# EasyEDA Pro project 分电板.eprj

# Schematic Schematic1
Board Name: Board1; Create Date: 2024-11-13; Page Name: P1; Project Name: 分电板; Schematic Name: Schematic1; Update Date: 2024-11-14; Company: 嘉立创EDA; Page Size: A4; Version: V1.0
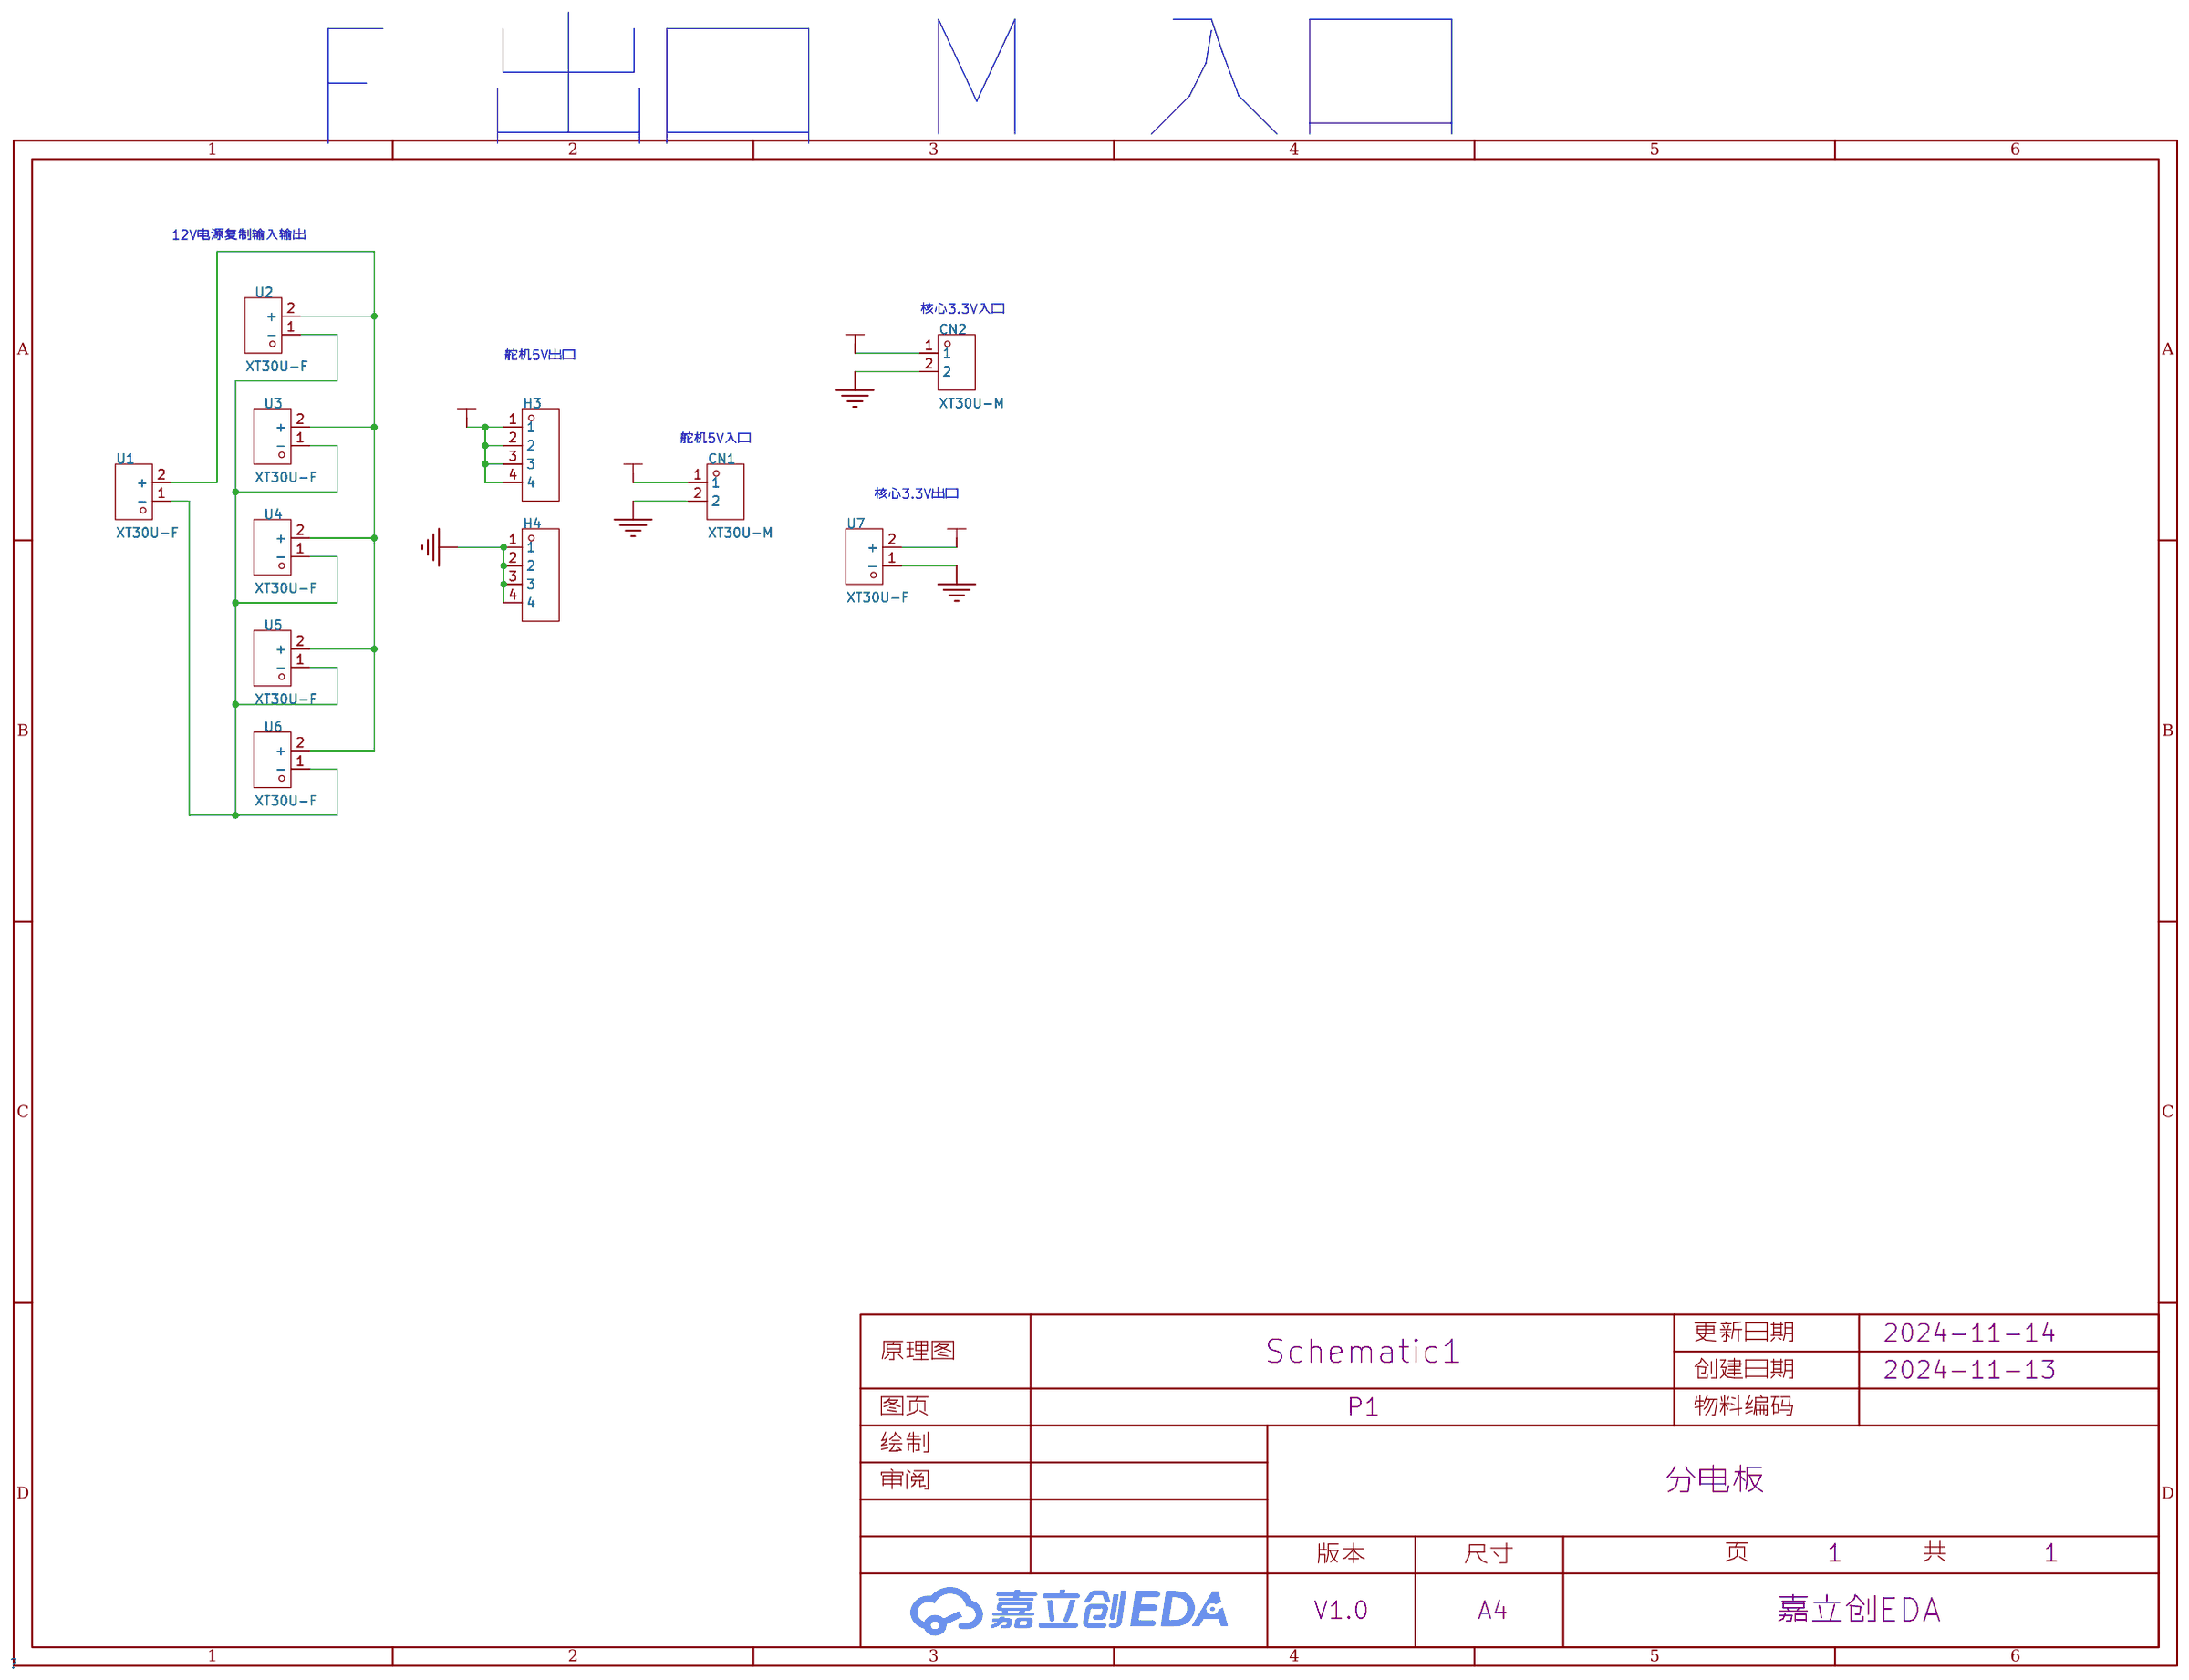
[diagram p0: schematic sheet]

## Parts
CN1  XT30U-M  [CONN-TH_XT30U-M]
CN2  XT30U-M  [CONN-TH_XT30U-M]
H3  -  [HDR-TH_4P-P2.54-V-M]
H4  -  [HDR-TH_4P-P2.54-V-M]
U1  XT30U-F  [CONN-TH_XT30U-F]
U2  XT30U-F  [CONN-TH_XT30U-F]
U3  XT30U-F  [CONN-TH_XT30U-F]
U4  XT30U-F  [CONN-TH_XT30U-F]
U5  XT30U-F  [CONN-TH_XT30U-F]
U6  XT30U-F  [CONN-TH_XT30U-F]
U7  XT30U-F  [CONN-TH_XT30U-F]

## Library data of the parts
CN1 CN2 = XT30U-M: LCSC Part Name: AMASS(艾迈斯)轻量版锂电池插头公头 XT30U-M; Supplier Part: C99101; Manufacturer: AMASS(艾迈斯); JLCPCB Part Class: Extended Part; Datasheet: https://atta.szlcsc.com/upload/public/pdf/source/20170606/1496716542582.pdf; Supplier: LCSC; Brand: 艾迈斯; Type: 插头; Colour: 黄色; InterfaceType: 公头
H3 H4 = HDR-M_2.54_1x4P: Supplier Part: C492403; Supplier Footprint: 插件
U1-U7 = XT30U-F: LCSC Part Name: AMASS(艾迈斯)轻量版锂电池插头母头 XT30U-F; Supplier Part: C99102; Manufacturer: AMASS(艾迈斯); JLCPCB Part Class: Extended Part; Datasheet: https://atta.szlcsc.com/upload/public/pdf/source/20190916/C428721_B0ECB8C5937139CEFE8736D2D3175B0E.pdf; Supplier: LCSC; Brand: 艾迈斯; Type: 插头; Colour: 黄色; InterfaceType: 母头

## Nets
3.3V: CN2.1 U7.2(+)
5V: CN1.1 H3.1 H3.2 H3.3 H3.4
GND: CN1.2 CN2.2 H4.1 H4.2 H4.3 H4.4 U7.1(-)
$1N694: U1.2(+) U2.2(+) U3.2(+) U4.2(+) U5.2(+) U6.2(+)
$1N789: U1.1(-) U2.1(-) U3.1(-) U4.1(-) U5.1(-) U6.1(-)

## Notes on the sheet
- M 入口
- F 出口
- 12V电源复制输入输出
- 核心3.3V入口
- 舵机5V出口
- 舵机5V入口
- 核心3.3V出口

# Board PCB1
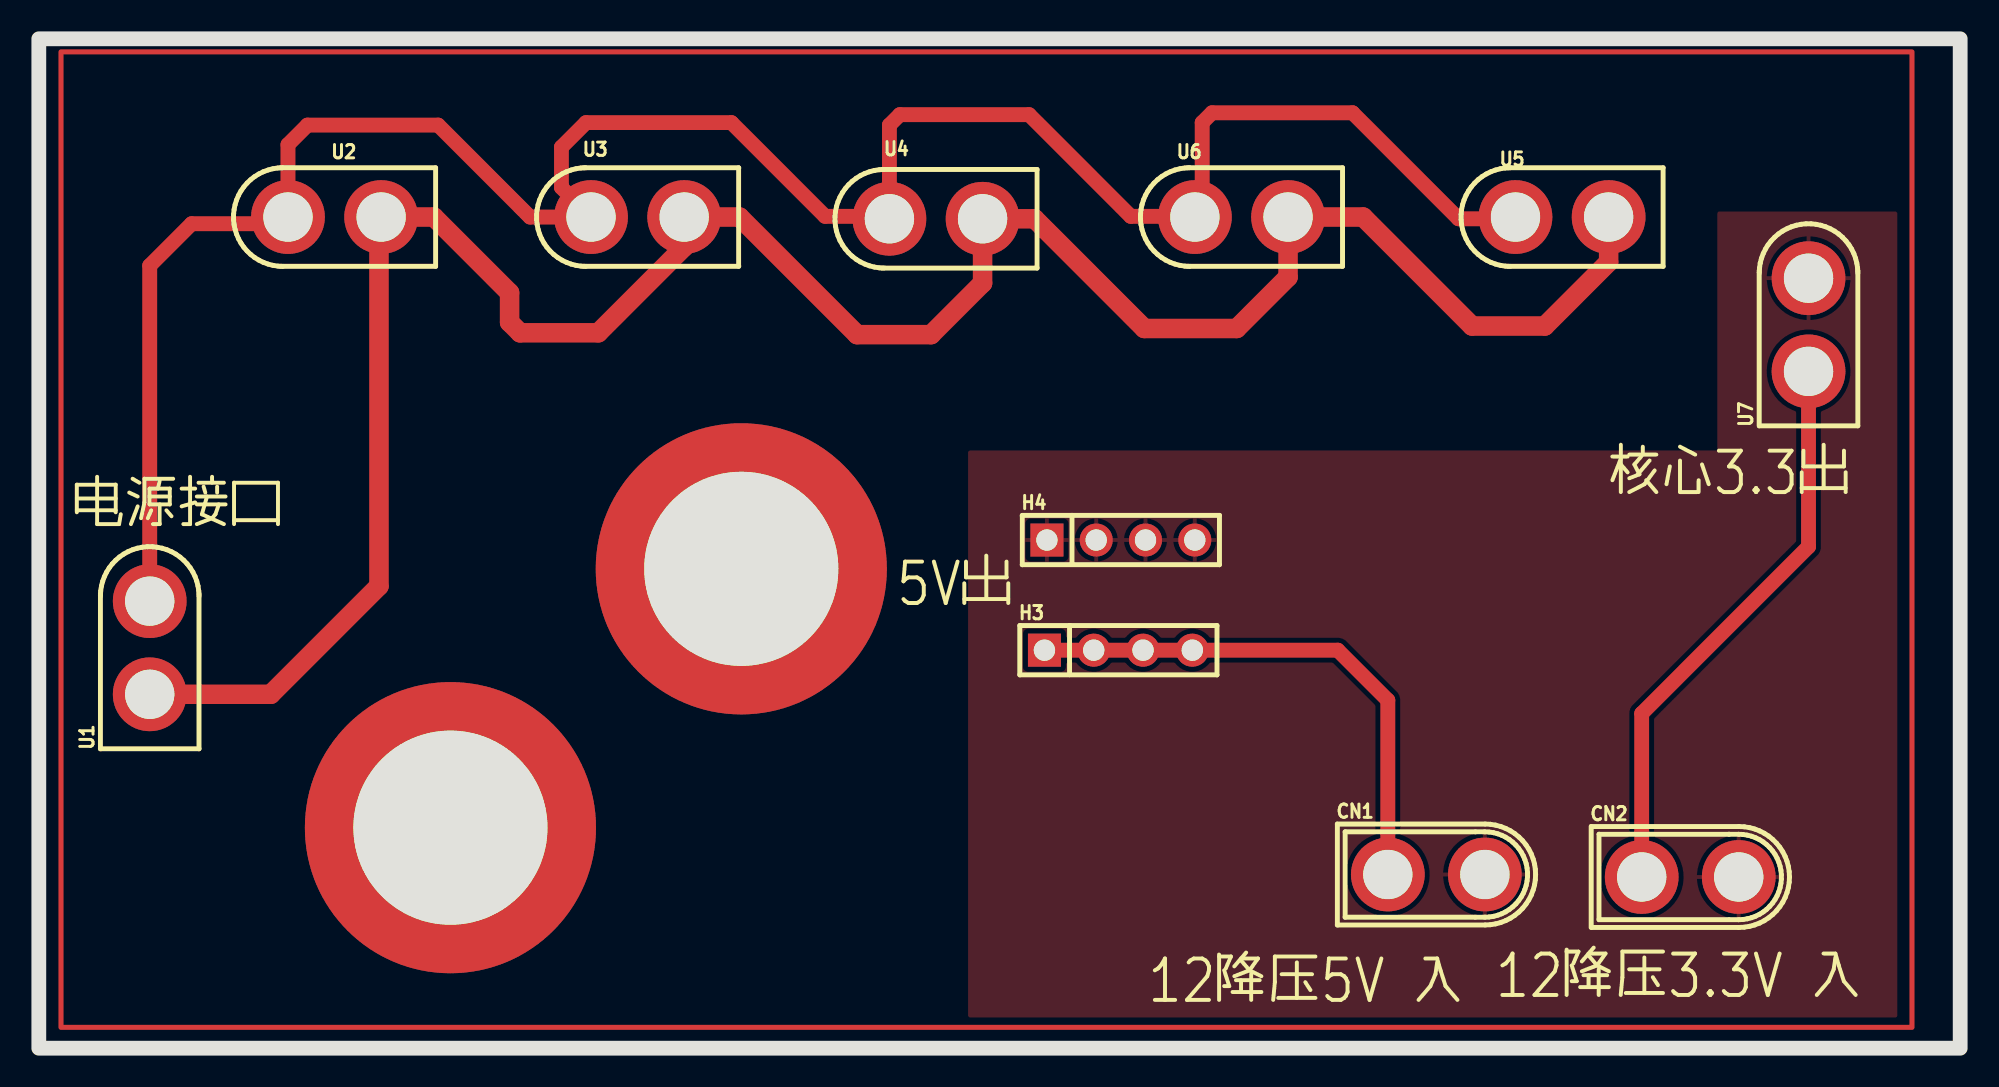
[diagram p1: board, top side]
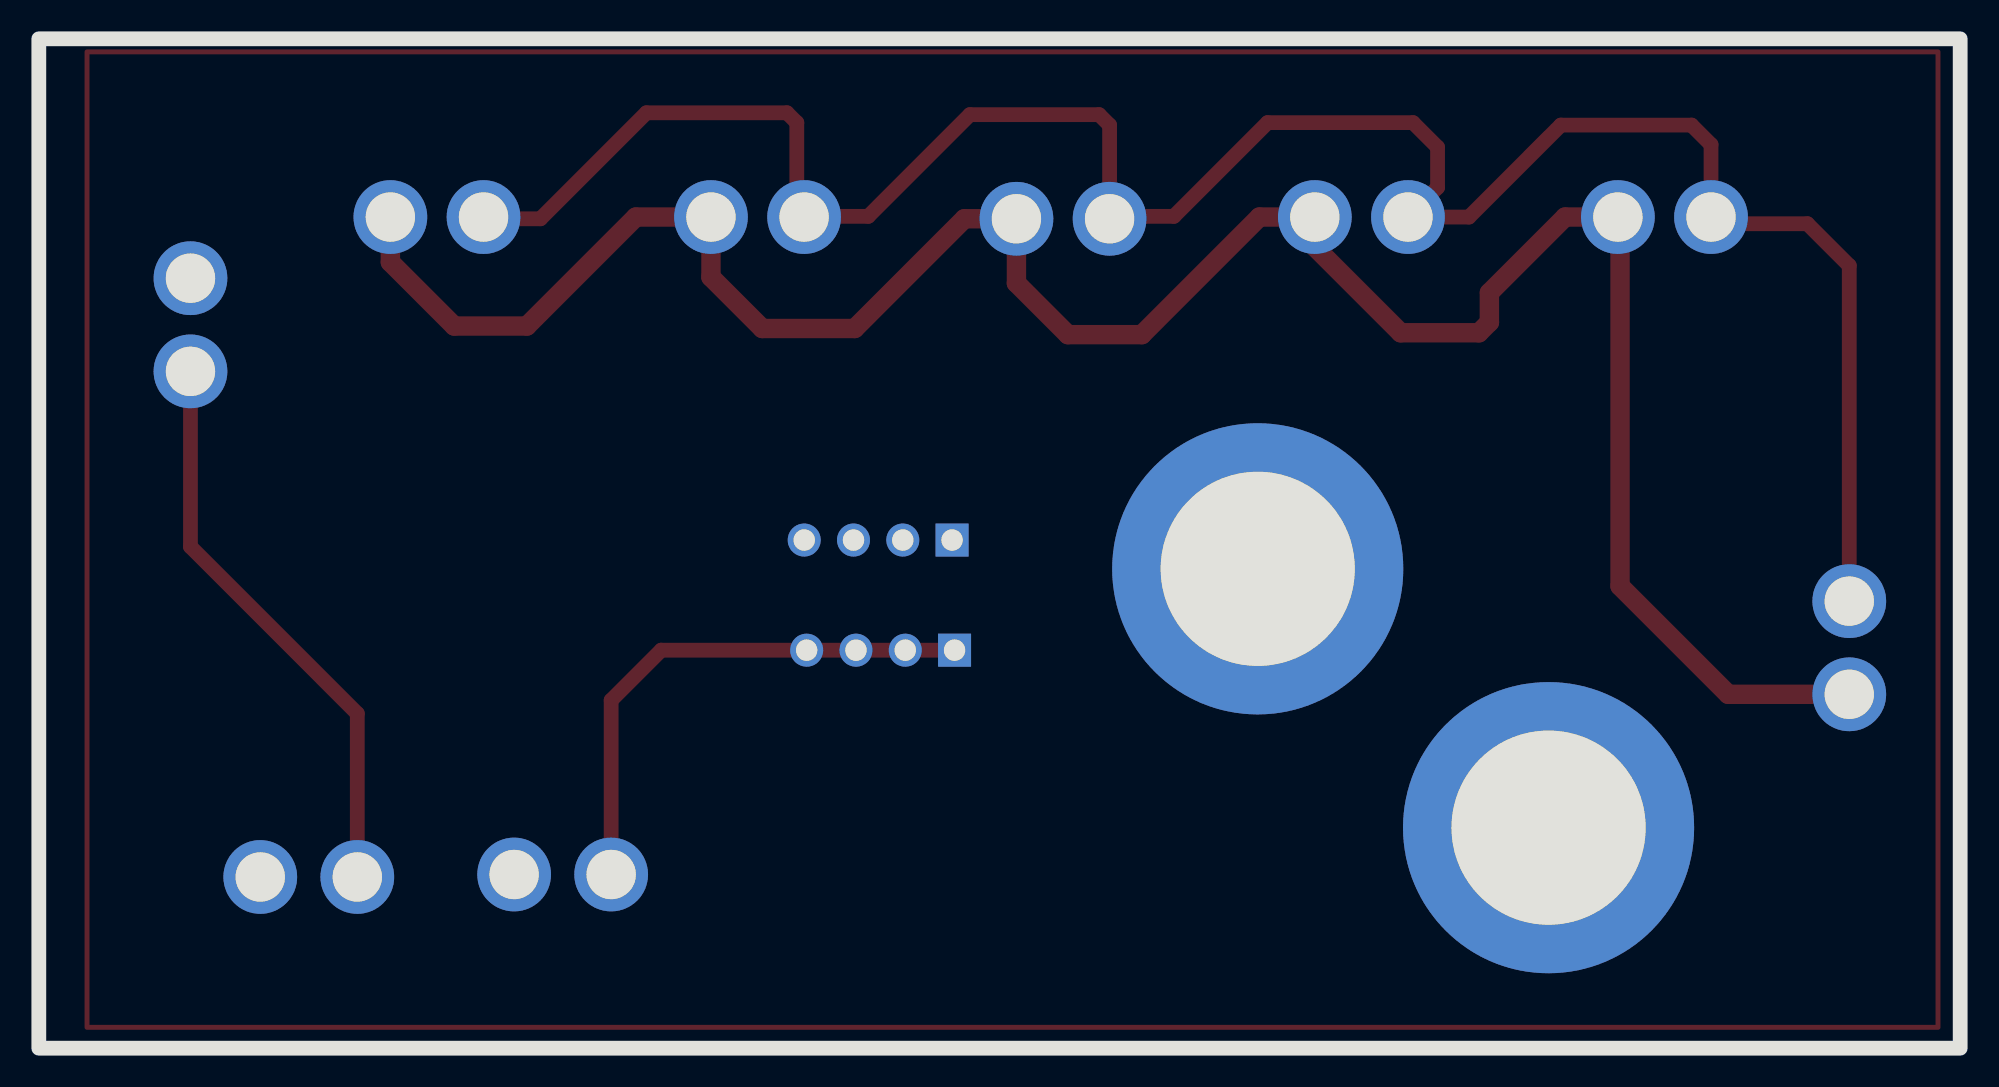
[diagram p2: board, bottom side, seen from below]

Outline 99 x 52 mm; copper layers: Top Layer, Bottom Layer. Coordinates in mm from the lower left corner of the outline.
Outline path: rectangle 0,52 99,0
Stack: Top Layer 0.035mm / Dielectric1 1.51mm FR4 er 4.5 / Bottom Layer 0.035mm

## Design rules (mm)
template: 自定义配置
spacing copperThickness1oz (default): track to track 0.102, other pairs 0.152 to 0.3
spacing copperThickness2oz: track to track 0.203, other pairs 0.152 to 0.3
track width copperThickness1oz (default): min 0.127, default 0.762, max 2.54
track width copperThickness2oz: min 0.203, default 0.254, max 2.54
differential pair differentialPair (default): width min 0.127, default 0.254, max 2.54; gap min 0.152, default 0.152
via viaSize (default): diameter min 0.5, default 0.61, max 10; hole min 0.3, default 0.305, max 6.3

## Placement (name value [footprint] x y rotation side)
CN1  XT30U-M  [CONN-TH_XT30U-M]  72.01 8.95 0 top
CN2  XT30U-M  [CONN-TH_XT30U-M]  85.09 8.82 0 top
H3  -  [HDR-TH_4P-P2.54-V-M]  55.63 20.5 0 top
H4  -  [HDR-TH_4P-P2.54-V-M]  55.75 26.18 0 top
NOREF  -  [Pad_e383]  21.21 11.36 0 top
NOREF#2  -  [Pad_e56]  36.19 24.69 0 top
U1  XT30U-F  [CONN-TH_XT30U-F]  5.72 20.63 90 top
U2  XT30U-F  [CONN-TH_XT30U-F]  15.24 42.82 180 top
U3  XT30U-F  [CONN-TH_XT30U-F]  30.85 42.82 180 top
U4  XT30U-F  [CONN-TH_XT30U-F]  46.23 42.73 180 top
U5  XT30U-F  [CONN-TH_XT30U-F]  78.49 42.82 180 top
U6  XT30U-F  [CONN-TH_XT30U-F]  61.97 42.82 180 top
U7  XT30U-F  [CONN-TH_XT30U-F]  91.19 37.27 90 top

## Footprints (pads in the part's own frame, mm; a bottom-side part is the same pattern mirrored in y, then rotated)
CONN-TH_XT30U-F
  round 3.8 hole 2.54: 1(2.4,0) 2(-2.4,0)
CONN-TH_XT30U-M
  round 3.8 hole 2.54: 1(-2.5,0) 2(2.5,0)
HDR-TH_4P-P2.54-V-M
  rect 1.7x1.7 hole 1.1: 1(-3.81,0)
  round 1.7 hole 1.1: 2(-1.27,0) 3(1.27,0) 4(3.81,0)
Pad_e56
  round 15 hole 10: 1(0,0)
Pad_e383
  round 15 hole 10: 1(0,0)

## Nets
As in the schematic.

Pads without a net: NOREF 1; NOREF#2 1

## Routing (per net, layer and track width the routed paths; a pad name or vN(x,y) marks a point on that pad's centre or on a via; arc(x,y) is an arc through that point)
3.3V: length 29.6
  Top Layer w0.762: U7.2 91.19,25.84 82.59,17.24 CN2.1
5V: length 27.7
  Top Layer w0.762: CN1.1 69.51,17.92 66.93,20.5 H3.4 H3.3 H3.2 H3.1
$1N694: length 122.6
  Top Layer w1: U5.2 80.89,40.49 77.6,37.2 73.85,37.2 68.24,42.82 U6.2 64.37,39.72 61.72,37.08 56.96,37.08 51.31,42.73 U4.2 48.63,39.41 45.97,36.76 42.16,36.76 36.11,42.82 U3.2 33.25,41.28 28.83,36.86 24.8,36.86 24.26,37.39 24.26,38.92 20.36,42.82 U2.2 17.53,42.71 17.53,23.81 11.95,18.23 5.72,18.23
$1N789: length 117.5
  Top Layer w0.762: 76.09,42.82 76,42.73 73.15,42.73 67.69,48.19 60.45,48.19 59.94,47.68 59.94,43.19 U6.1 59.53,42.86 56.26,42.86 51.02,48.09 44.37,48.09 43.83,47.55 U4.1 43.7,42.86 40.51,42.86 35.69,47.68 28.19,47.68 26.93,46.42 26.93,44.34 U3.1 25.31,42.82 20.57,47.55 13.84,47.55 12.84,46.55 U2.1 12.5,42.47 7.87,42.47 5.72,40.32 U1.1

## Copper pours and planes (outline as drawn; the poured copper is in the pictures)
GND on Top Layer: 96.14,43.1 86.62,43.1 86.49,43.24 86.49,30.79 47.88,30.79 47.88,1.2 47.75,1.07 96.01,1.07 96.14,1.2 96.14,43.1

## Text on the board
Top Silkscreen Layer: 电源接口 | 5V出 | 12降压5V 入 | 12降压3.3V 入 | 核心3.3出
